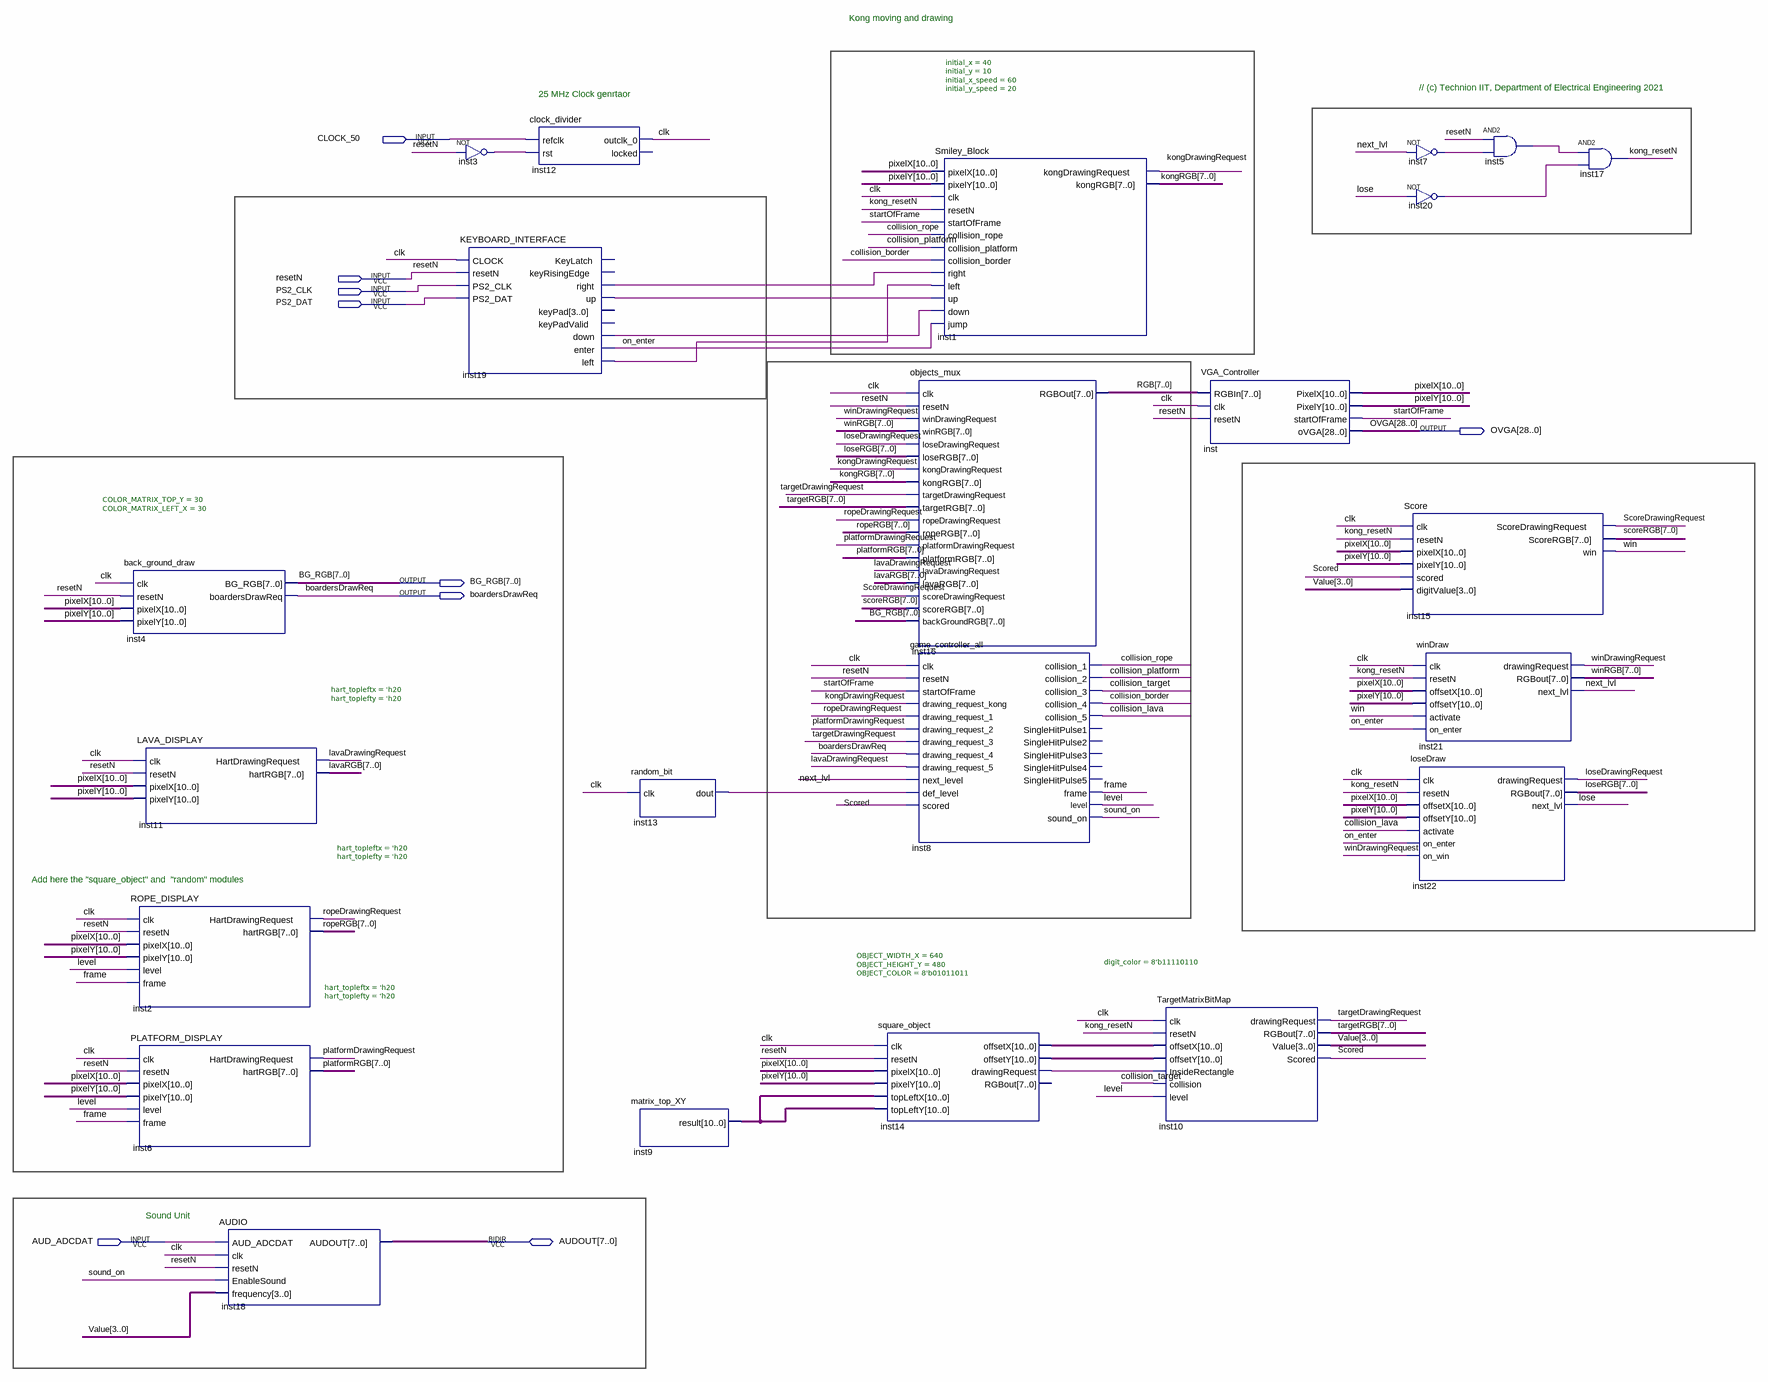
[diagram p0: schematic sheet]
// Quartus schematic TOP_VGA_DEMO_KBD.bdf as structural Verilog: 23 symbols, 9 pins
module TOP_VGA_DEMO_KBD (
  input  CLOCK_50,
  input  resetN,
  input  PS2_CLK,
  input  PS2_DAT,
  input  AUD_ADCDAT,
  inout  [7:0] AUDOUT,
  output [28:0] OVGA,
  output [7:0] BG_RGB,
  output boardersDrawReq
);

  wire clk, collision_border, collision_lava, collision_platform, collision_rope, collision_target, frame,
       inst3_out, inst5_out, inst7_out, inst13_dout, inst14_drawingrequest, inst19_down, inst19_left,
       inst19_right, inst19_up, inst20_out, kong_resetN, kongDrawingRequest, lavaDrawingRequest, level, lose,
       loseDrawingRequest, next_lvl, on_enter, platformDrawingRequest, ropeDrawingRequest, Scored,
       ScoreDrawingRequest, sound_on, startOfFrame, targetDrawingRequest, win, winDrawingRequest;
  wire [3:0] Value;
  wire [7:0] kongRGB, lavaRGB, loseRGB, platformRGB, RGB, ropeRGB, scoreRGB, targetRGB, winRGB;
  wire [10:0] inst9_result, inst14_offsetx, inst14_offsety, pixelX, pixelY;

  back_ground_draw #(.COLOR_MATRIX_TOP_Y(30), .COLOR_MATRIX_LEFT_X(30)) inst4 (
    .clk(clk), .resetN(resetN), .pixelX(pixelX), .pixelY(pixelY), .BG_RGB(BG_RGB),
    .boardersDrawReq(boardersDrawReq));
  LAVA_DISPLAY #(.hart_topleftx('h20), .hart_toplefty('h20)) inst11 (
    .clk(clk), .resetN(resetN), .pixelX(pixelX), .pixelY(pixelY), .HartDrawingRequest(lavaDrawingRequest),
    .hartRGB(lavaRGB));
  ROPE_DISPLAY #(.hart_topleftx('h20), .hart_toplefty('h20)) inst2 (
    .clk(clk), .resetN(resetN), .pixelX(pixelX), .pixelY(pixelY), .level(level), .frame(frame),
    .HartDrawingRequest(ropeDrawingRequest), .hartRGB(ropeRGB));
  PLATFORM_DISPLAY #(.hart_topleftx('h20), .hart_toplefty('h20)) inst6 (
    .clk(clk), .resetN(resetN), .pixelX(pixelX), .pixelY(pixelY), .level(level), .frame(frame),
    .HartDrawingRequest(platformDrawingRequest), .hartRGB(platformRGB));
  AUDIO inst18 (
    .AUD_ADCDAT(AUD_ADCDAT), .clk(clk), .resetN(resetN), .EnableSound(sound_on), .frequency(Value),
    .AUDOUT(AUDOUT));
  not inst3 (inst3_out, resetN);
  KEYBOARD_INTERFACE inst19 (
    .CLOCK(clk), .resetN(resetN), .PS2_CLK(PS2_CLK), .PS2_DAT(PS2_DAT), .right(inst19_right), .up(inst19_up),
    .down(inst19_down), .enter(on_enter), .left(inst19_left));  // open: KeyLatch, keyRisingEdge, keyPad, keyPadValid
  clock_divider inst12 (.refclk(CLOCK_50), .rst(inst3_out), .outclk_0(clk));  // open: locked
  random_bit inst13 (.clk(clk), .dout(inst13_dout));
  matrix_top_XY inst9 (.result(inst9_result));
  square_object #(.OBJECT_WIDTH_X(640), .OBJECT_HEIGHT_Y(480), .OBJECT_COLOR(8'b01011011)) inst14 (
    .clk(clk), .resetN(resetN), .pixelX(pixelX), .pixelY(pixelY), .topLeftX(inst9_result),
    .topLeftY(inst9_result), .offsetX(inst14_offsetx), .offsetY(inst14_offsety),
    .drawingRequest(inst14_drawingrequest));  // open: RGBout
  objects_mux inst16 (
    .clk(clk), .resetN(resetN), .winDrawingRequest(winDrawingRequest), .winRGB(winRGB),
    .loseDrawingRequest(loseDrawingRequest), .loseRGB(loseRGB), .kongDrawingRequest(kongDrawingRequest),
    .kongRGB(kongRGB), .targetDrawingRequest(targetDrawingRequest), .targetRGB(targetRGB),
    .ropeDrawingRequest(ropeDrawingRequest), .ropeRGB(ropeRGB),
    .platformDrawingRequest(platformDrawingRequest), .platformRGB(platformRGB),
    .lavaDrawingRequest(lavaDrawingRequest), .lavaRGB(lavaRGB), .scoreDrawingRequest(ScoreDrawingRequest),
    .scoreRGB(scoreRGB), .backGroundRGB(BG_RGB), .RGBOut(RGB));
  game_controller_all inst8 (
    .clk(clk), .resetN(resetN), .startOfFrame(startOfFrame), .drawing_request_kong(kongDrawingRequest),
    .drawing_request_1(ropeDrawingRequest), .drawing_request_2(platformDrawingRequest),
    .drawing_request_3(targetDrawingRequest), .drawing_request_4(boardersDrawReq),
    .drawing_request_5(lavaDrawingRequest), .next_level(next_lvl), .def_level(inst13_dout), .scored(Scored),
    .collision_1(collision_rope), .collision_2(collision_platform), .collision_3(collision_target),
    .collision_4(collision_border), .collision_5(collision_lava), .frame(frame), .level(level),
    .sound_on(sound_on));  // open: SingleHitPulse1, SingleHitPulse2, SingleHitPulse3, SingleHitPulse4, SingleHitPulse5
  Smiley_Block #(.initial_x(40), .initial_y(10), .initial_x_speed(60), .initial_y_speed(20)) inst1 (
    .pixelX(pixelX), .pixelY(pixelY), .clk(clk), .resetN(kong_resetN), .startOfFrame(startOfFrame),
    .collision_rope(collision_rope), .collision_platform(collision_platform),
    .collision_border(collision_border), .right(inst19_right), .left(inst19_left), .up(inst19_up),
    .down(inst19_down), .jump(on_enter), .kongDrawingRequest(kongDrawingRequest), .kongRGB(kongRGB));
  TargetMatrixBitMap #(.digit_color(8'b11110110)) inst10 (
    .clk(clk), .resetN(kong_resetN), .offsetX(inst14_offsetx), .offsetY(inst14_offsety),
    .InsideRectangle(inst14_drawingrequest), .collision(collision_target), .level(level),
    .drawingRequest(targetDrawingRequest), .RGBout(targetRGB), .Value(Value), .Scored(Scored));
  VGA_Controller inst (
    .RGBIn(RGB), .clk(clk), .resetN(resetN), .PixelX(pixelX), .PixelY(pixelY), .startOfFrame(startOfFrame),
    .oVGA(OVGA));
  not inst7 (inst7_out, next_lvl);
  not inst20 (inst20_out, lose);
  Score inst15 (
    .clk(clk), .resetN(kong_resetN), .pixelX(pixelX), .pixelY(pixelY), .scored(Scored), .digitValue(Value),
    .ScoreDrawingRequest(ScoreDrawingRequest), .ScoreRGB(scoreRGB), .win(win));
  winDraw inst21 (
    .clk(clk), .resetN(kong_resetN), .offsetX(pixelX), .offsetY(pixelY), .activate(win), .on_enter(on_enter),
    .drawingRequest(winDrawingRequest), .RGBout(winRGB), .next_lvl(next_lvl));
  loseDraw inst22 (
    .clk(clk), .resetN(kong_resetN), .offsetX(pixelX), .offsetY(pixelY), .activate(collision_lava),
    .on_enter(on_enter), .on_win(winDrawingRequest), .drawingRequest(loseDrawingRequest), .RGBout(loseRGB),
    .next_lvl(lose));
  and inst5 (inst5_out, resetN, inst7_out);
  and inst17 (kong_resetN, inst5_out, inst20_out);

  // Notes on the sheet:
  //   Kong moving and drawing
  //   // (c) Technion IIT, Department of Electrical Engineering 2021
  //   25 MHz Clock genrtaor
  //   Add here the "square_object" and  "random" modules
  //   Sound Unit
endmodule
